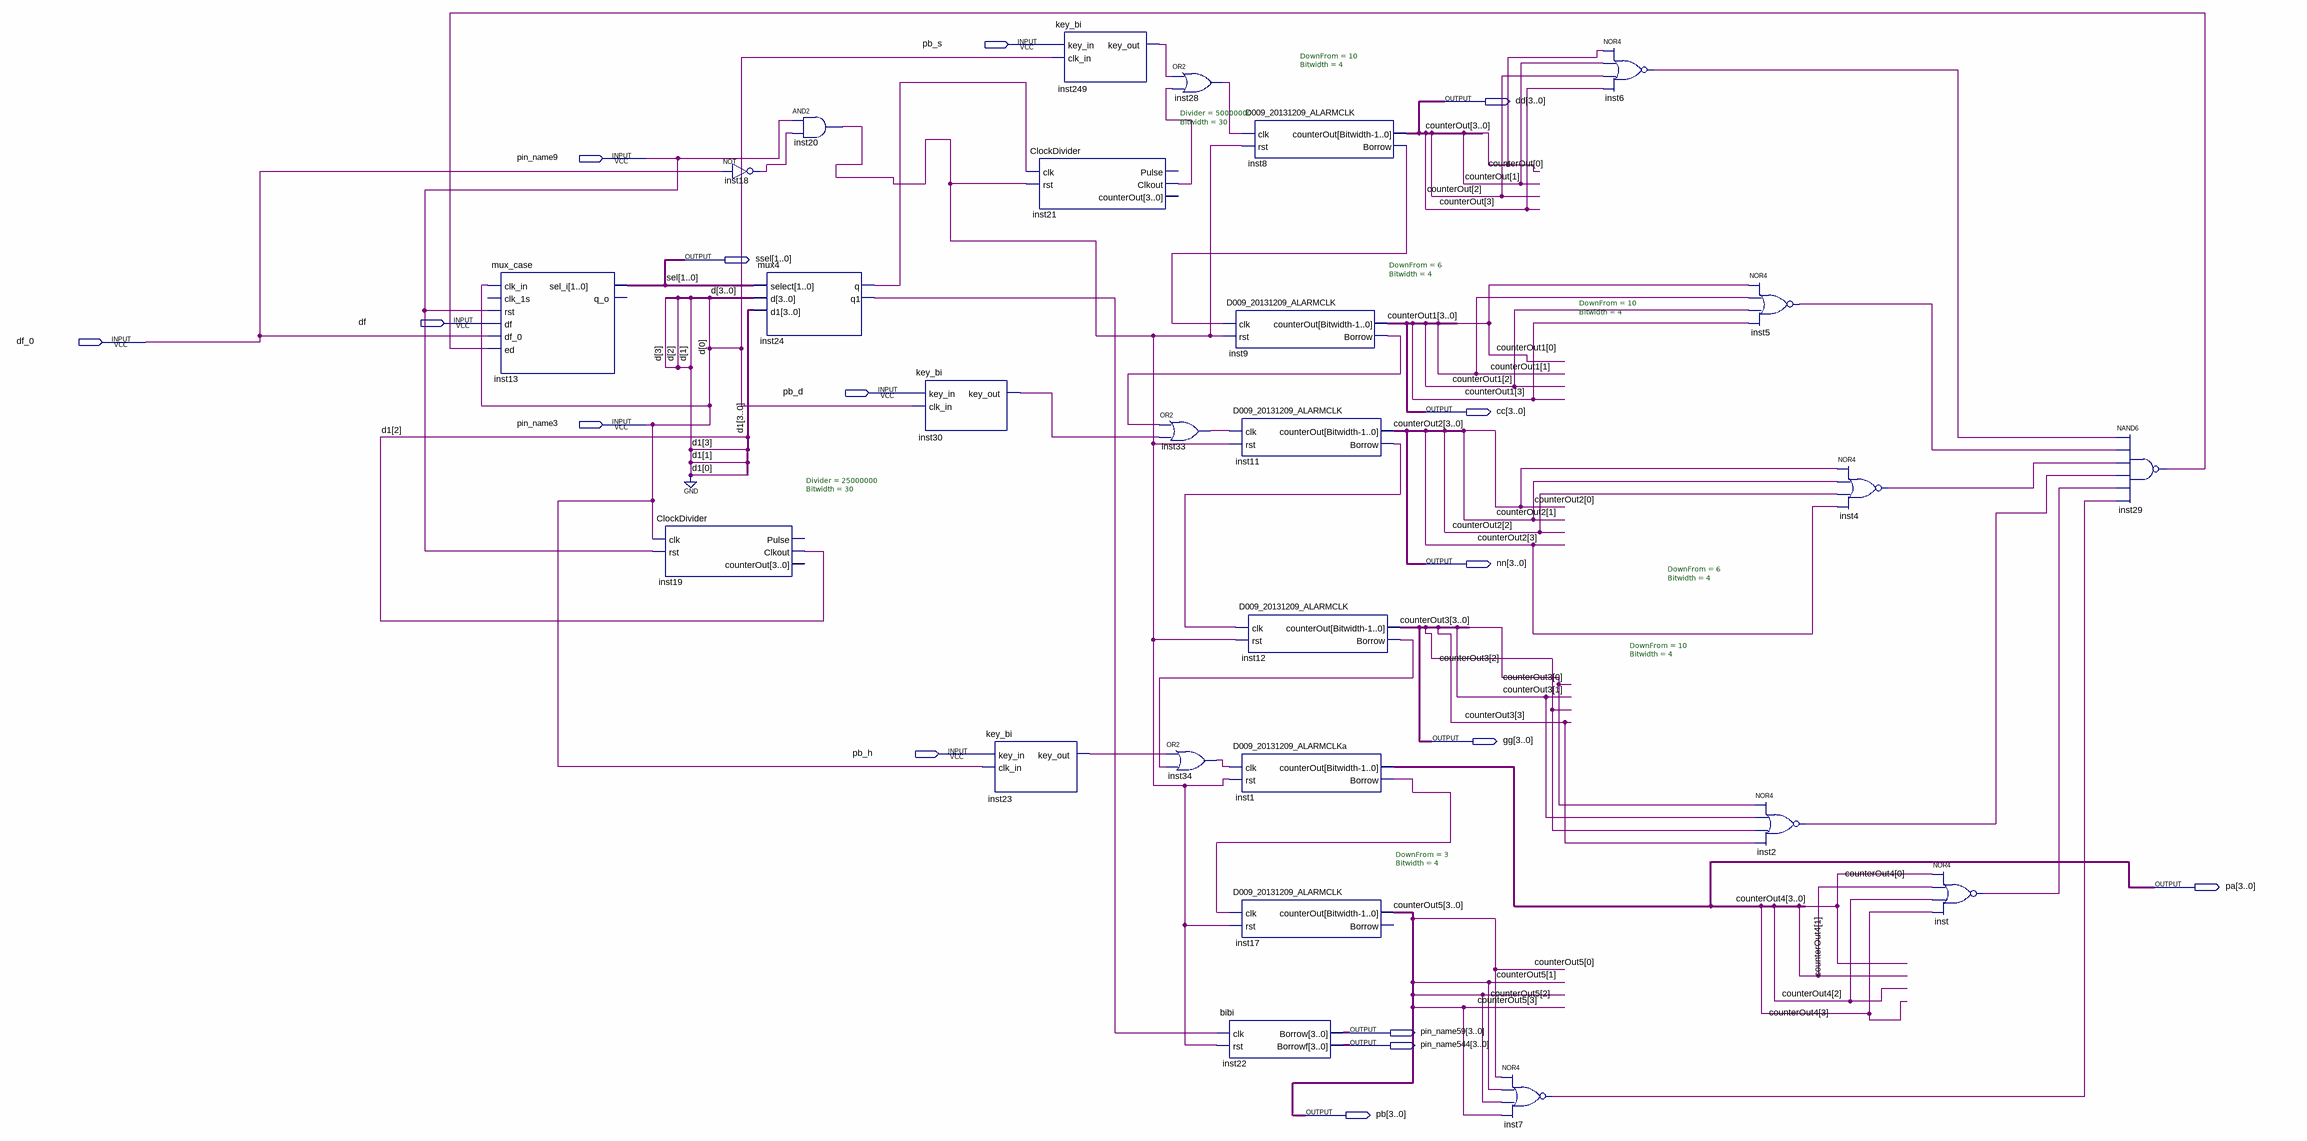
[diagram p0: schematic sheet]
// Quartus schematic Block1.bdf as structural Verilog: 26 symbols, 16 pins
module Block1 (
  input  pb_s,
  input  pin_name9,
  input  df,
  input  df_0,
  input  pb_d,
  input  pin_name3,
  input  pb_h,
  output [3:0] dd,
  output [1:0] ssel,
  output [3:0] cc,
  output [3:0] nn,
  output [3:0] gg,
  output [3:0] pa,
  output [3:0] pin_name59,
  output [3:0] pin_name544,
  output [3:0] pb
);

  wire inst1_borrow, inst2_out, inst4_out, inst5_out, inst6_out, inst7_out, inst8_borrow, inst9_borrow,
       inst11_borrow, inst12_borrow, inst18_out, inst20_out, inst21_clkout, inst23_key_out, inst24_q,
       inst24_q1, inst28_out, inst29_out, inst30_key_out, inst33_out, inst34_out, inst249_key_out, inst_out;
  wire [2:2] d1;

  mux_case inst13 (
    .clk_in(pin_name3), .rst(pin_name9), .df(df), .df_0(df_0), .ed(inst29_out), .sel_i(ssel));  // open: clk_1s, q_o
  ClockDivider #(.Divider(25000000), .Bitwidth(30)) inst19 (
    .clk(pin_name3), .rst(pin_name9), .Clkout(d1[2]));  // open: Pulse, counterOut
  not inst18 (inst18_out, df_0);
  and inst20 (inst20_out, pin_name9, inst18_out);
  mux4 inst24 (.select(ssel), .d({3'b000, pin_name3}), .d1({1'b0, d1[2], 2'b00}), .q(inst24_q), .q1(inst24_q1));
  key_bi inst30 (.key_in(pb_d), .clk_in(pin_name3), .key_out(inst30_key_out));
  key_bi inst23 (.key_in(pb_h), .clk_in(pin_name3), .key_out(inst23_key_out));
  key_bi inst249 (.key_in(pb_s), .clk_in(pin_name3), .key_out(inst249_key_out));
  ClockDivider #(.Divider(50000000), .Bitwidth(30)) inst21 (
    .clk(inst24_q), .rst(inst20_out), .Clkout(inst21_clkout));  // open: Pulse, counterOut
  or inst28 (inst28_out, inst249_key_out, inst21_clkout);
  or inst33 (inst33_out, inst9_borrow, inst30_key_out);
  or inst34 (inst34_out, inst23_key_out, inst12_borrow);
  D009_20131209_ALARMCLK #(.DownFrom(10), .Bitwidth(4)) inst8 (
    .clk(inst28_out), .rst(inst20_out), .counterOut(dd), .Borrow(inst8_borrow));
  D009_20131209_ALARMCLK #(.DownFrom(6), .Bitwidth(4)) inst9 (
    .clk(inst8_borrow), .rst(inst20_out), .counterOut(cc), .Borrow(inst9_borrow));
  D009_20131209_ALARMCLK #(.DownFrom(10), .Bitwidth(4)) inst11 (
    .clk(inst33_out), .rst(inst20_out), .counterOut(nn), .Borrow(inst11_borrow));
  D009_20131209_ALARMCLK #(.DownFrom(6), .Bitwidth(4)) inst12 (
    .clk(inst11_borrow), .rst(inst20_out), .counterOut(gg), .Borrow(inst12_borrow));
  D009_20131209_ALARMCLKa #(.DownFrom(10), .Bitwidth(4)) inst1 (
    .clk(inst34_out), .rst(inst20_out), .counterOut(pa), .Borrow(inst1_borrow));
  D009_20131209_ALARMCLK #(.DownFrom(3), .Bitwidth(4)) inst17 (
    .clk(inst1_borrow), .rst(inst20_out), .counterOut(pb));  // open: Borrow
  bibi inst22 (.clk(inst24_q1), .rst(inst20_out), .Borrow(pin_name59), .Borrowf(pin_name544));
  nor inst7 (inst7_out, pb[0], pb[1], pb[2], pb[3]);
  nor inst6 (inst6_out, dd[0], dd[1], dd[2], dd[3]);
  nor inst5 (inst5_out, cc[0], cc[1], cc[2], cc[3]);
  nor inst2 (inst2_out, gg[0], gg[1], gg[2], gg[3]);
  nor inst4 (inst4_out, nn[0], nn[1], nn[2], nn[3]);
  nor inst (inst_out, pa[0], pa[1], pa[2], pa[3]);
  nand inst29 (inst29_out, inst6_out, inst5_out, inst4_out, inst2_out, inst_out, inst7_out);

  // Other names for the same wires on the sheet: counterOut1[3:0] = cc; counterOut5[3:0] = pb; counterOut[3:0] = dd;
  //   counterOut3[3:0] = gg; counterOut2[3:0] = nn; counterOut4[3:0] = pa; d[0] = pin_name3; sel[1:0] = ssel
endmodule
